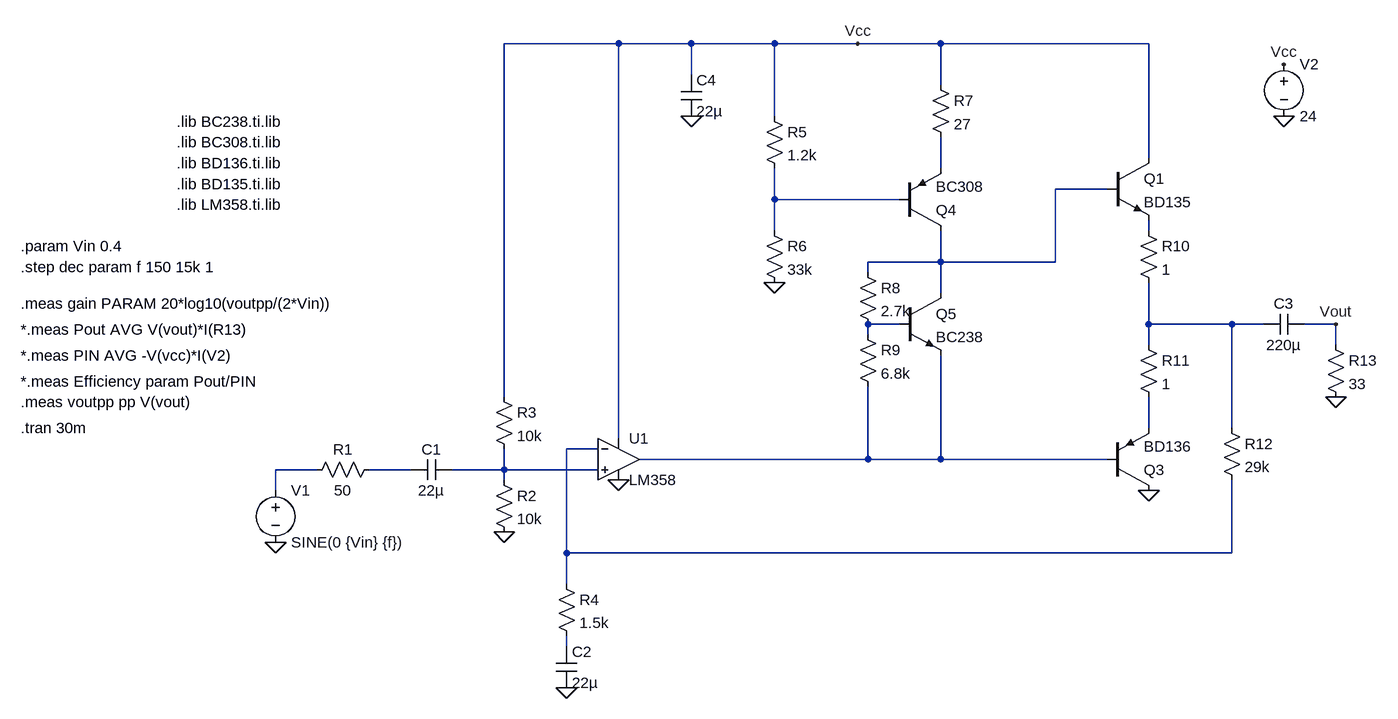
[diagram p0: schematic ECDLab3.asc]
ECDLab3.asc, the LTspice schematic file:
Version 4
SHEET 1 1848 680
WIRE 544 -528 368 -528
WIRE 656 -528 544 -528
WIRE 784 -528 656 -528
WIRE 912 -528 784 -528
WIRE 1040 -528 912 -528
WIRE 1360 -528 1040 -528
WIRE 656 -480 656 -528
WIRE 1040 -464 1040 -528
WIRE 784 -416 784 -528
WIRE 1360 -352 1360 -528
WIRE 1040 -336 1040 -384
WIRE 1296 -304 1216 -304
WIRE 784 -288 784 -336
WIRE 976 -288 784 -288
WIRE 784 -240 784 -288
WIRE 1360 -240 1360 -256
WIRE 1040 -192 1040 -240
WIRE 1040 -192 928 -192
WIRE 1216 -192 1216 -304
WIRE 1216 -192 1040 -192
WIRE 928 -176 928 -192
WIRE 1040 -144 1040 -192
WIRE 976 -96 928 -96
WIRE 1360 -96 1360 -160
WIRE 1488 -96 1360 -96
WIRE 1536 -96 1488 -96
WIRE 1648 -96 1600 -96
WIRE 928 -80 928 -96
WIRE 1360 -64 1360 -96
WIRE 1648 -64 1648 -96
WIRE 368 16 368 -528
WIRE 1360 64 1360 16
WIRE 1488 64 1488 -96
WIRE 544 80 544 -528
WIRE 512 96 464 96
WIRE 928 112 928 0
WIRE 928 112 576 112
WIRE 1040 112 1040 -48
WIRE 1040 112 928 112
WIRE 1296 112 1040 112
WIRE 80 128 16 128
WIRE 224 128 160 128
WIRE 368 128 368 96
WIRE 368 128 288 128
WIRE 512 128 368 128
WIRE 368 144 368 128
WIRE 16 160 16 128
WIRE 464 256 464 96
WIRE 1488 256 1488 144
WIRE 1488 256 464 256
WIRE 464 304 464 256
WIRE 464 400 464 384
FLAG 16 240 0
FLAG 464 464 0
FLAG 544 144 0
FLAG 784 -160 0
FLAG 1360 160 0
FLAG 1648 16 0
FLAG 1568 -416 0
FLAG 656 -416 0
FLAG 1568 -496 Vcc
FLAG 912 -528 Vcc
FLAG 368 224 0
FLAG 1648 -96 Vout
SYMBOL voltage 16 144 R0
WINDOW 123 0 0 Left 0
WINDOW 39 0 0 Left 0
SYMATTR InstName V1
SYMATTR Value SINE(0 {Vin} {f})
SYMBOL res 176 112 R90
WINDOW 0 0 56 VBottom 2
WINDOW 3 32 56 VTop 2
SYMATTR InstName R1
SYMATTR Value 50
SYMBOL cap 288 112 R90
WINDOW 0 0 32 VBottom 2
WINDOW 3 32 32 VTop 2
SYMATTR InstName C1
SYMATTR Value 22µ
SYMBOL res 352 128 R0
SYMATTR InstName R2
SYMATTR Value 10k
SYMBOL res 352 0 R0
SYMATTR InstName R3
SYMATTR Value 10k
SYMBOL res 448 288 R0
SYMATTR InstName R4
SYMATTR Value 1.5k
SYMBOL cap 448 400 R0
SYMATTR InstName C2
SYMATTR Value 22µ
SYMBOL OpAmps\\opamp2 544 48 R0
SYMATTR InstName U1
SYMATTR Value LM358
SYMBOL res 768 -432 R0
SYMATTR InstName R5
SYMATTR Value 1.2k
SYMBOL res 768 -256 R0
SYMATTR InstName R6
SYMATTR Value 33k
SYMBOL pnp 976 -240 M180
SYMATTR InstName Q4
SYMATTR Value BC308
SYMBOL pnp 1296 160 M180
SYMATTR InstName Q3
SYMATTR Value BD136
SYMBOL npn 976 -144 R0
SYMATTR InstName Q5
SYMATTR Value BC238
SYMBOL npn 1296 -352 R0
SYMATTR InstName Q1
SYMATTR Value BD135
SYMBOL res 1024 -480 R0
SYMATTR InstName R7
SYMATTR Value 27
SYMBOL res 912 -192 R0
SYMATTR InstName R8
SYMATTR Value 2.7k
SYMBOL res 912 -96 R0
SYMATTR InstName R9
SYMATTR Value 6.8k
SYMBOL res 1344 -256 R0
SYMATTR InstName R10
SYMATTR Value 1
SYMBOL res 1344 -80 R0
SYMATTR InstName R11
SYMATTR Value 1
SYMBOL res 1472 48 R0
SYMATTR InstName R12
SYMATTR Value 29k
SYMBOL cap 1600 -112 R90
WINDOW 0 0 32 VBottom 2
WINDOW 3 32 32 VTop 2
SYMATTR InstName C3
SYMATTR Value 220µ
SYMBOL res 1632 -80 R0
SYMATTR InstName R13
SYMATTR Value 33
SYMBOL voltage 1568 -512 R0
WINDOW 123 0 0 Left 0
WINDOW 39 0 0 Left 0
SYMATTR InstName V2
SYMATTR Value 24
SYMBOL cap 640 -480 R0
SYMATTR InstName C4
SYMATTR Value 22µ
TEXT -136 -408 Left 2 !.lib BC238.ti.lib
TEXT -136 -376 Left 2 !.lib BC308.ti.lib
TEXT -136 -344 Left 2 !.lib BD136.ti.lib
TEXT -136 -312 Left 2 !.lib BD135.ti.lib
TEXT -136 -280 Left 2 !.lib LM358.ti.lib
TEXT -376 -216 Left 2 !.param Vin 0.4
TEXT -376 -184 Left 2 !.step dec param f 150 15k 1
TEXT -376 -88 Left 2 !*.meas Pout AVG V(vout)*I(R13)
TEXT -376 -48 Left 2 !*.meas PIN AVG -V(vcc)*I(V2)
TEXT -376 -8 Left 2 !*.meas Efficiency param Pout/PIN
TEXT -376 24 Left 2 !.meas voutpp pp V(vout)
TEXT -376 -128 Left 2 !.meas gain PARAM 20*log10(voutpp/(2*Vin))
TEXT -376 64 Left 2 !.tran 30m

The netlist it stands for:
* ECDLab3.asc
V1 N010 0 SINE(0 {Vin} {f})
R1 N011 N010 50
C1 N012 N011 22µ
R2 N012 0 10k
R3 Vcc N012 10k
R4 N008 N013 1.5k
C2 N013 0 22µ
XU1 N012 N008 Vcc 0 N009 LM358  ; pins In+ In- V+ V- OUT
R5 Vcc N003 1.2k
R6 N003 0 33k
Q4 N002 N003 N001 0 BC308
Q3 0 N009 N007 0 BD136
Q5 N002 N005 N009 0 BC238
Q1 Vcc N002 N004 0 BD135
R7 Vcc N001 27
R8 N002 N005 2.7k
R9 N005 N009 6.8k
R10 N004 N006 1
R11 N006 N007 1
R12 N006 N008 29k
C3 Vout N006 220µ
R13 Vout 0 33
V2 Vcc 0 24
C4 Vcc 0 22µ
.model NPN NPN
.model PNP PNP
.lib standard.bjt
.lib BC238.ti.lib
.lib BC308.ti.lib
.lib BD136.ti.lib
.lib BD135.ti.lib
.lib LM358.ti.lib
.param Vin 0.4
.step dec param f 150 15k 1
*.meas Pout AVG V(vout)*I(R13)
*.meas PIN AVG -V(vcc)*I(V2)
*.meas Efficiency param Pout/PIN
.meas voutpp pp V(vout)
.meas gain PARAM 20*log10(voutpp/(2*Vin))
.tran 30m
.backanno
.end